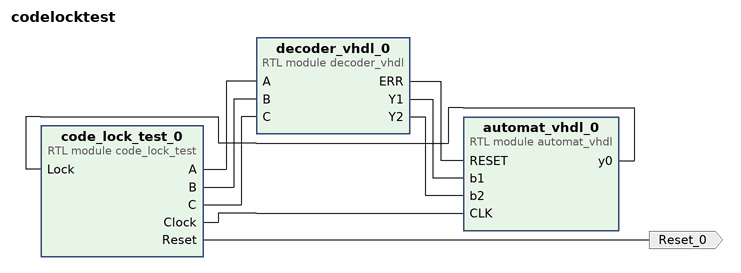
[diagram p0: block diagram of the top level]
# Vivado block design codelocktest, xc7a35tcpg236-1, Vivado 2018.3
create_bd_design codelocktest

create_bd_port -dir O -type rst Reset_0

create_bd_cell -type module -reference automat_vhdl automat_vhdl_0
create_bd_cell -type module -reference decoder_vhdl decoder_vhdl_0
create_bd_cell -type module -reference code_lock_test code_lock_test_0
set_property -dict {CONFIG.C_FSM_TYPE MEALY} [get_bd_cells code_lock_test_0]

# ---- connections ----

connect_bd_net [get_bd_pins decoder_vhdl_0/ERR] [get_bd_pins automat_vhdl_0/RESET]
connect_bd_net [get_bd_pins decoder_vhdl_0/Y1] [get_bd_pins automat_vhdl_0/b1]
connect_bd_net [get_bd_pins decoder_vhdl_0/Y2] [get_bd_pins automat_vhdl_0/b2]
connect_bd_net [get_bd_pins code_lock_test_0/A] [get_bd_pins decoder_vhdl_0/A]
connect_bd_net [get_bd_pins code_lock_test_0/B] [get_bd_pins decoder_vhdl_0/B]
connect_bd_net [get_bd_pins code_lock_test_0/C] [get_bd_pins decoder_vhdl_0/C]
connect_bd_net [get_bd_pins automat_vhdl_0/y0] [get_bd_pins code_lock_test_0/Lock]
connect_bd_net [get_bd_pins code_lock_test_0/Clock] [get_bd_pins automat_vhdl_0/CLK]
connect_bd_net [get_bd_pins code_lock_test_0/Reset] [get_bd_ports Reset_0]

validate_bd_design
save_bd_design
